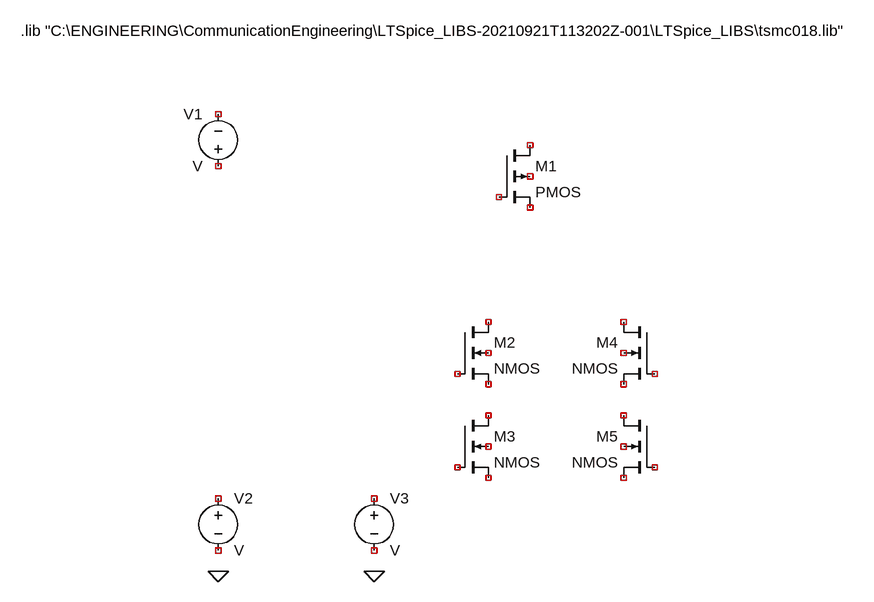
[diagram p0: schematic Draft2.asc]
Draft2.asc, the LTspice schematic file:
Version 4
SHEET 1 1316 804
FLAG 224 784 0
FLAG 464 784 0
SYMBOL voltage 224 176 R180
WINDOW 0 24 96 Left 2
WINDOW 3 24 16 Left 2
SYMATTR InstName V1
SYMBOL voltage 224 656 R0
SYMATTR InstName V2
SYMBOL voltage 464 656 R0
SYMATTR InstName V3
SYMBOL pmos4 656 128 R0
SYMATTR InstName M1
SYMBOL nmos4 592 400 R0
SYMATTR InstName M2
SYMBOL nmos4 592 544 R0
SYMATTR InstName M3
SYMBOL nmos4 896 400 M0
SYMATTR InstName M4
SYMBOL nmos4 896 544 M0
SYMATTR InstName M5
TEXT -80 -48 Left 2 !.lib "C:\\ENGINEERING\\CommunicationEngineering\\LTSpice_LIBS-20210921T113202Z-001\\LTSpice_LIBS\\tsmc018.lib"

The netlist it stands for:
* Draft2.asc
V1 NC_01 NC_02 V
V2 NC_03 NC_04 V
V3 NC_05 NC_06 V
M1 NC_07 NC_08 NC_09 NC_10 PMOS
M2 NC_11 NC_12 NC_13 NC_14 NMOS
M3 NC_15 NC_16 NC_17 NC_18 NMOS
M4 NC_19 NC_20 NC_21 NC_22 NMOS
M5 NC_23 NC_24 NC_25 NC_26 NMOS
.model NMOS NMOS
.model PMOS PMOS
.lib standard.mos
.lib "C:\ENGINEERING\CommunicationEngineering\LTSpice_LIBS-20210921T113202Z-001\LTSpice_LIBS\tsmc018.lib"
.backanno
.end